# Altium schematic sheet PLWD_Bluetooth.SchDoc
size A4; SheetNumber: 2; SheetTotal: 11
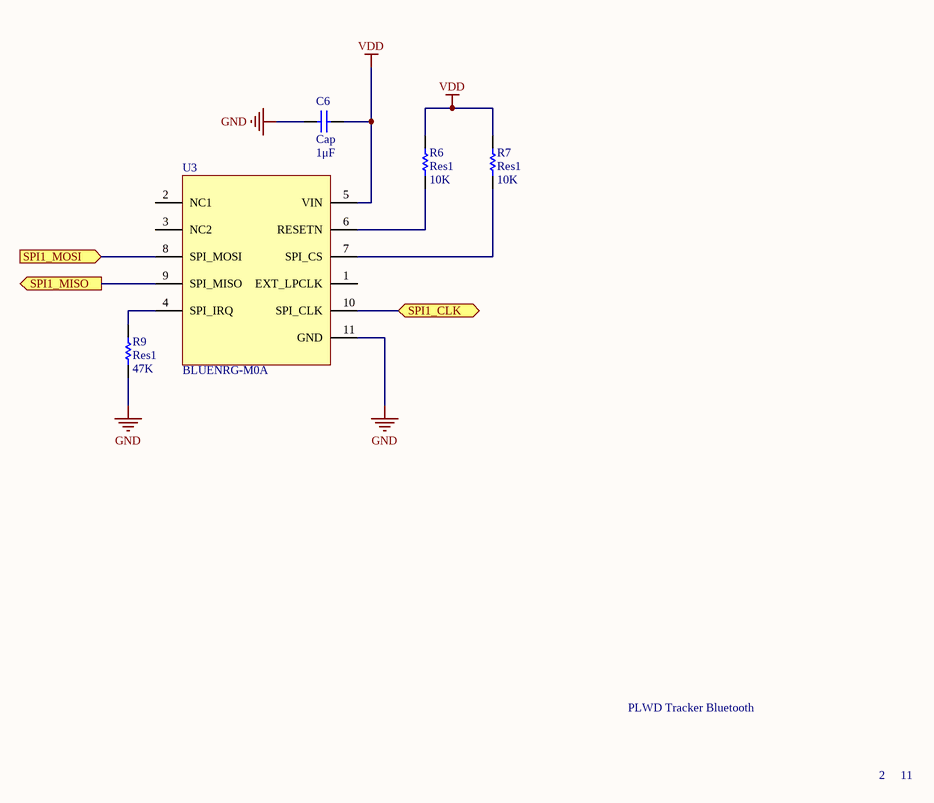
[diagram p0: PLWD_Bluetooth.SchDoc]

## Parts
C6  Cap  value 1μF  [RAD-0.3]
R6  Res1  value 10K  [AXIAL-0.3]
R7  Res1  value 10K  [AXIAL-0.3]
R9  Res1  value 47K  [AXIAL-0.3]
U3  BLUENRG-M0A

## Ports
SPI1_CLK (bidir), SPI1_MISO (out), SPI1_MOSI (in)

## Nets
GND: C6.1 R9.1 U3.11(GND)
VDD: C6.2 R6.2 R7.2 U3.5(VIN)
SPI1_CLK: U3.10(SPI_CLK) ; port SPI1_CLK
SPI1_MISO: U3.9(SPI_MISO) ; port SPI1_MISO
SPI1_MOSI: U3.8(SPI_MOSI) ; port SPI1_MOSI
NetR6_1: R6.1 U3.6(RESETN)
NetR7_1: R7.1 U3.7(SPI_CS)
NetR9_2: R9.2 U3.4(SPI_IRQ)

Not connected (* = marked no-connect by the designer): U3 1(EXT_LPCLK) 2(NC1) 3(NC2)

## Notes on the sheet
- PLWD Tracker Bluetooth
- 2
- 11

## Library data of the parts
C6 = Cap: Capacitor; Published: 8-Jun-2000; LatestRevisionDate: 17-Jul-2002; LatestRevisionNote: Re-released for DXP Platform.; PackageReference: RAD-0.3; Publisher: Altium Limited; PackageDescription: Radial Cap, Thru-Hole; 2 Leads; 0.3 in Pin Spacing
R6 R7 R9 = Res1: Resistor; Published: 8-Jun-2000; LatestRevisionDate: 17-Jul-2002; LatestRevisionNote: Re-released for DXP Platform.; PackageReference: AXIAL-0.3; Publisher: Altium Limited; PackageDescription: Axial Device, Thru-Hole; 2 Leads; 0.3 in Pin Spacing
U3 = BLUENRG-M0A: Very low power network processor module for Bluetooth® low energy v4.2; Manufacturer: STMicroelectronics; Supplier 1: Digi-Key; Manufacturer Part Number: BLUENRG-M0A; RoHS: Yes; Category: RF Receivers, Transceivers; Pricing 1: 1=12.60000, 10=11.54700, 25=10.49720, 100=9.44740, 250=8.66008, 500=8.34996 (USD); RoHS Compliant: Yes; Supplier Part Number 1: 497-BLUENRG-M0ACT-ND